# Altium schematic sheet 07_MOTOR.SchDoc
size A4; PageSetup: Record=PageOptions|CenterHorizontal=True|CenterVertical=True|PrintScale=0.97|XCorrection=1.00|YCorrection=1.00|PrintKind=0|BorderSize=5000000|LeftOffset=0|BottomOffset=0|Orientation=2|PaperLength=1000|PaperWidth=1000|Scale=100|PaperSource=7|PrintQuality=-4|MediaType=1|DitherType=10|PaperKind=A4|PrintScaleMode=1
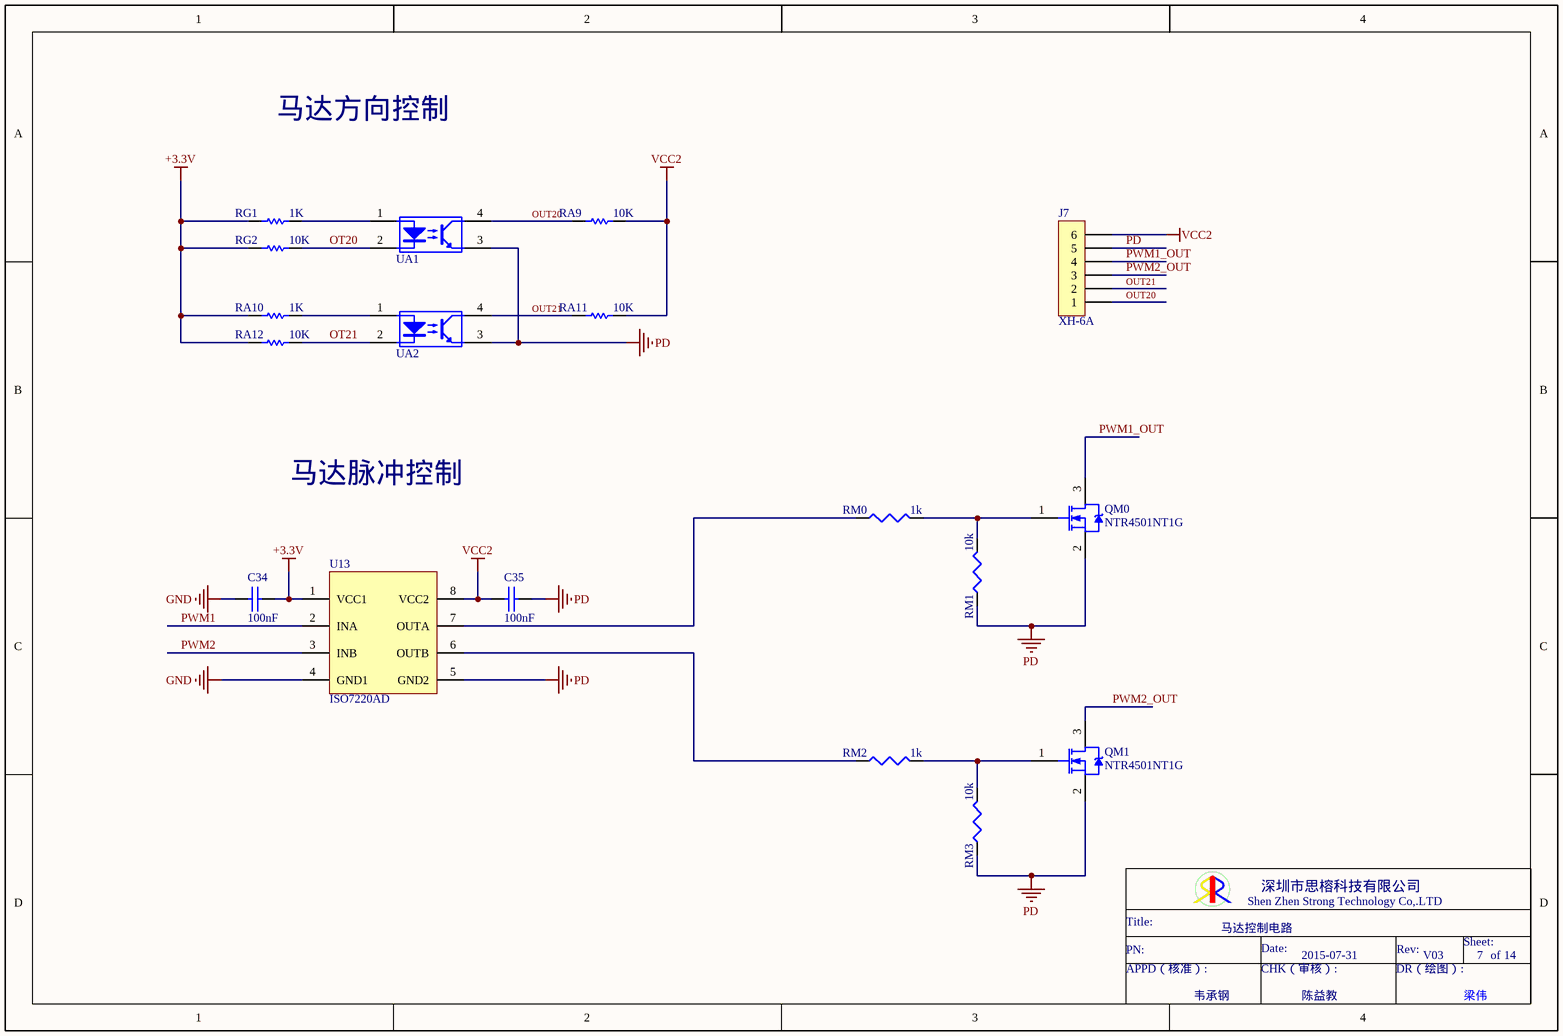
[diagram p0: 07_MOTOR.SchDoc]

## Parts
C34  100nF  [0603C]
C35  100nF  [0603C]
J7  XH-6A  [CN6-2.54]
QM0  NTR4501NT1G  [SOT23]
QM1  NTR4501NT1G  [SOT23]
RA9  10K  [0603R]
RA10  1K  [0603R]
RA11  10K  [0603R]
RA12  10K  [0603R]
RG1  1K  [0603R]
RG2  10K  [0603R]
RM0  1k  [0603R]
RM1  10k  [0603R]
RM2  1k  [0603R]
RM3  10k  [0603R]
U13  ISO7220AD  [SOP8]
UA1  AQY212GS  [SOP4-2.54]  (value not drawn)
UA2  AQY212GS  [SOP4-2.54]  (value not drawn)

## Nets
+3.3V: C34.2 RA10.1 RA12.1 RG1.1 RG2.1 U13.1(VCC1)
GND: C34.1 U13.4(GND1)
PD: C35.1 J7.5 QM0.2(S) QM1.2(S) RM1.1 RM3.1 U13.5(GND2) UA1.3(Emitter) UA2.3(Emitter)
VCC2: C35.2 J7.6 RA9.2 RA11.2 U13.8(VCC2)
OT20: RG2.2 UA1.2(LED_Cathode)
OT21: RA12.2 UA2.2(LED_Cathode)
OUT20: J7.1 RA9.1 UA1.4(Collector)
OUT21: J7.2 RA11.1 UA2.4(Collector)
PWM1: U13.2(INA)
PWM1_OUT: J7.4 QM0.3(D)
PWM2: U13.3(INB)
PWM2_OUT: J7.3 QM1.3(D)
NetQM0_1: QM0.1(G) RM0.2 RM1.2
NetQM1_1: QM1.1(G) RM2.2 RM3.2
NetRA10_2: RA10.2 UA2.1(LED_Anode)
NetRG1_2: RG1.2 UA1.1(LED_Anode)
NetRM0_1: RM0.1 U13.7(OUTA)
NetRM2_1: RM2.1 U13.6(OUTB)

## Notes on the sheet
- 马达方向控制
- 马达脉冲控制
- 马达控制电路
- 2015-07-31
- V03
- 7
- 14
- 韦承钢
- 陈益教
- Shen Zhen Strong Technology Co,.LTD
- 深圳市思榕科技有限公司
- Title:
- PN:
- APPD（核准）:
- Date:
- CHK（审核）:
- DR（绘图）:
- Rev:
- Sheet:
- of
- 梁伟

## Library data of the parts
C34 C35 = CAP
J7 = CON6: 单排
QM0 QM1 = MOSFET-N: MOSFET N沟道
RA9-RA12 RG1 RG2 = RES
RM0-RM3 = RES1
U13 = ISO7220: DUAL DIGITAL ISOLATOR
UA1 UA2 = TLP281